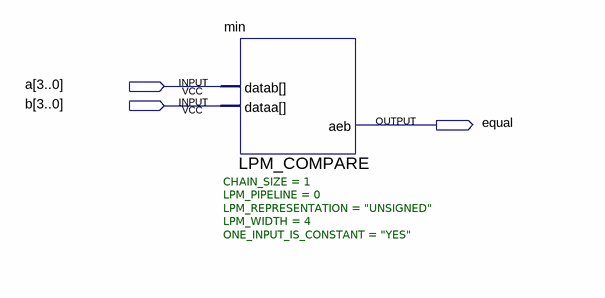
[diagram p0: schematic sheet]
// Quartus schematic octet_compare.bdf as structural Verilog: 1 symbols, 3 pins
module octet_compare (
  input  [3:0] a,
  input  [3:0] b,
  output equal
);

  LPM_COMPARE #(.CHAIN_SIZE(1), .LPM_PIPELINE(0), .LPM_REPRESENTATION("UNSIGNED"), .LPM_WIDTH(4), .ONE_INPUT_IS_CONSTANT("YES")) min (
    .dataa(b), .datab(a), .aeb(equal));
endmodule
